# EAGLE schematic FEU (EAGLE 6.1)
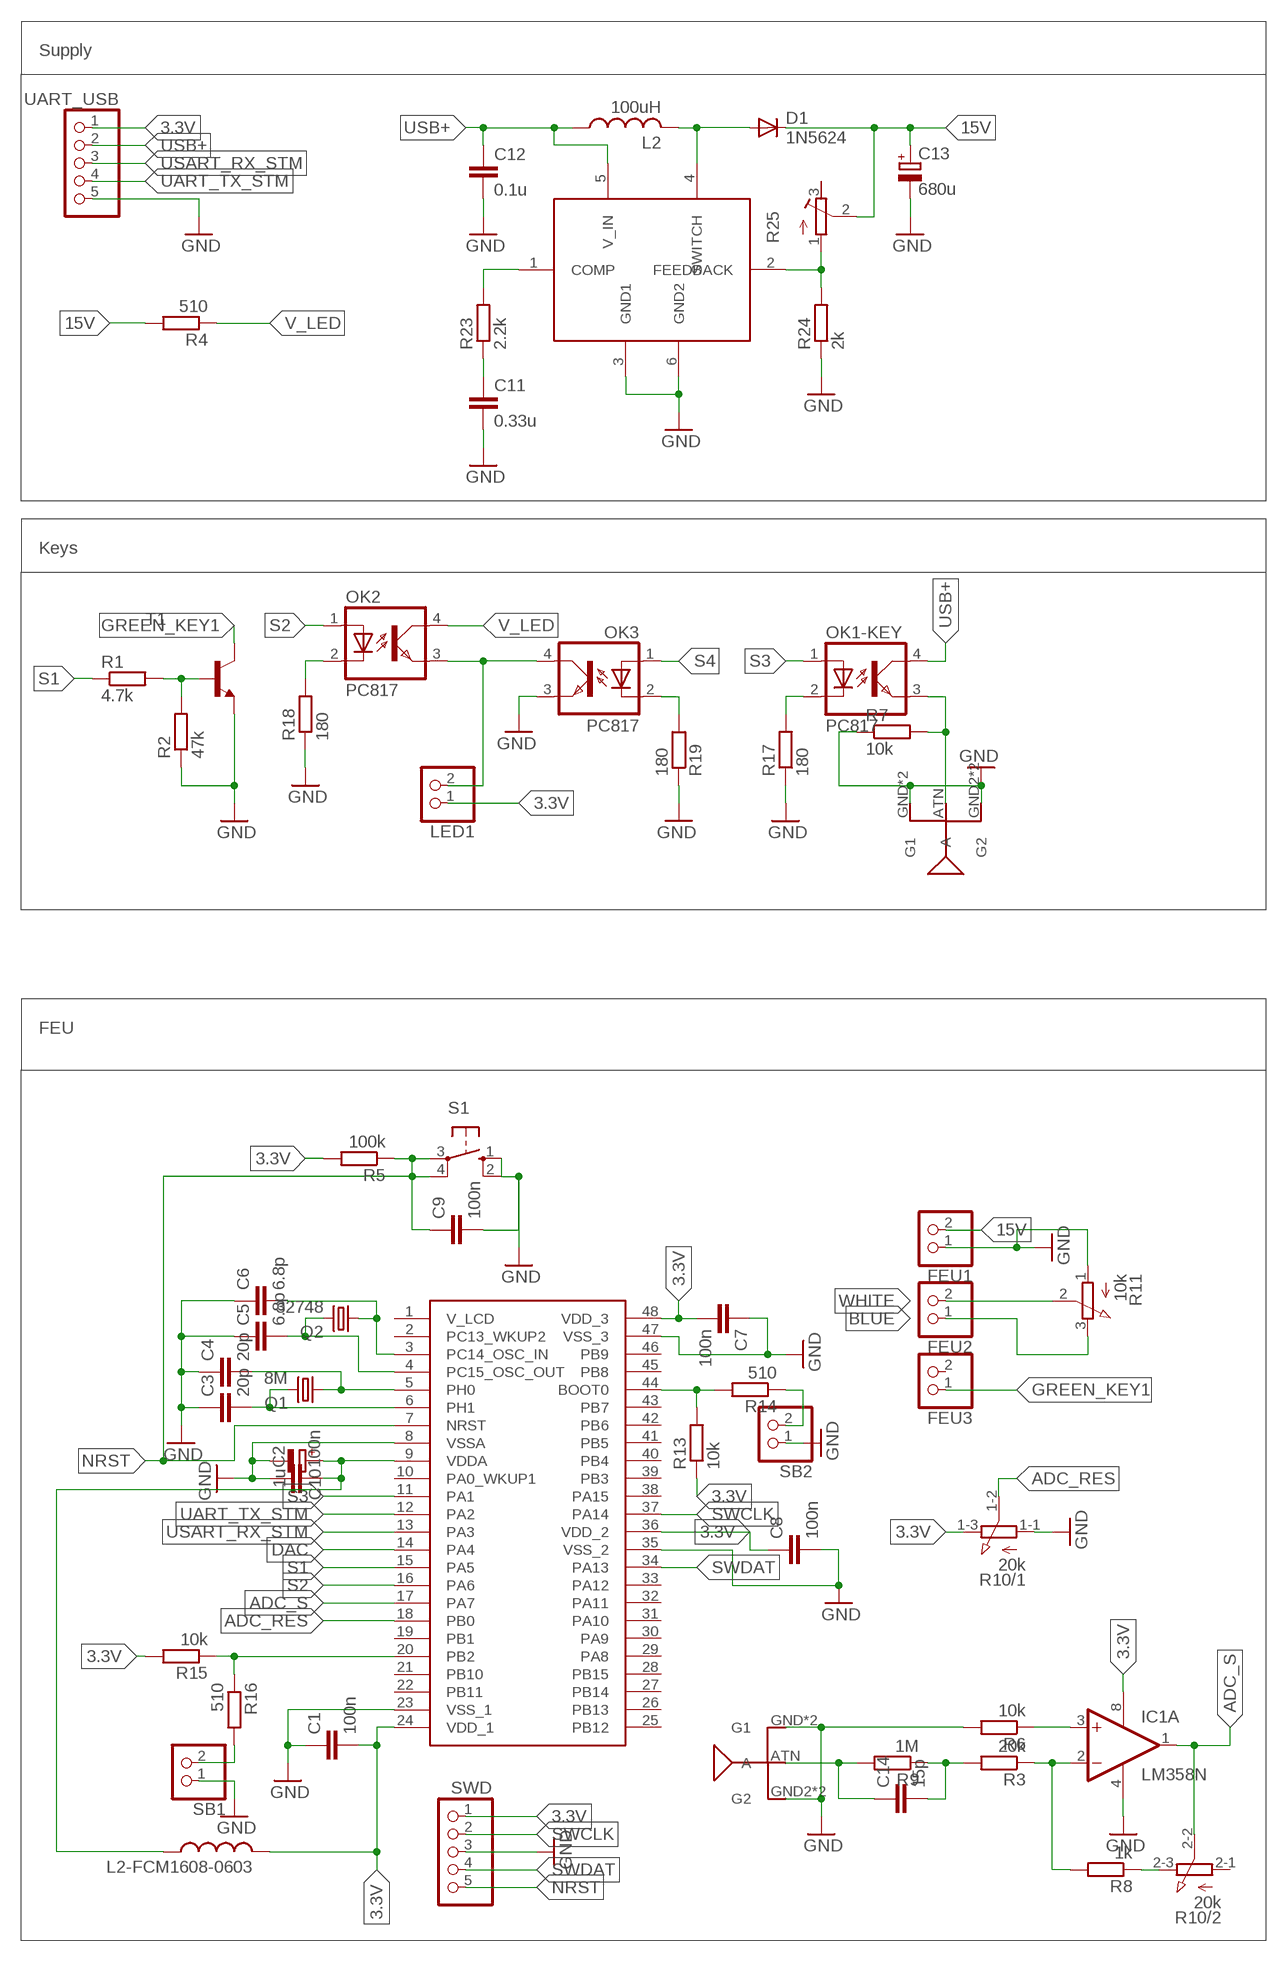
[diagram p0: schematic, sheet 1]

## Parts
C1  100n  C-EUC0805  [C0805]
C2  100n  C-EUC0805  [C0805]
C3  20p  C-EUC0805  [C0805]
C4  20p  C-EUC0805  [C0805]
C5  6.8p  C-EUC0805  [C0805]
C6  6.8p  C-EUC0805  [C0805]
C7  100n  C-EUC0805  [C0805]
C8  100n  C-EUC0805  [C0805]
C9  100n  C-EUC0805  [C0805]
C10  1u  CPOL-EUA/3216-18W  [A/3216-18W]
C11  0.33u  C-EUC0805  [C0805]
C12  0.1u  C-EUC0805  [C0805]
C13  680u  CPOL-EUE5-5  [E5-5]
C14  15p  C-EUC0805  [C0805]
D1  1N5624  [DO201-15]
FEU1  PINHD-1X2  [1X02]
FEU2  PINHD-1X2  [1X02]
FEU3  PINHD-1X2  [1X02]
IC1  LM358N  [DIL08]
L2  100uH  L-US0207/5V  [0207/5V]
L2-FCM1608-0603  L-USL3216C  [L3216C]
LED1  PINHD-1X2  [1X02]
OK1-KEY  PC817  [DIL04]
OK2  PC817  [DIL04]
OK3  PC817  [DIL04]
Q1  8M  CRYSTALHC49S  [HC49/S]
Q2  32748  CRYSTALTC26H  [TC26H]
R1  4.7k  R-EU_R0805  [R0805]
R2  47k  R-EU_R0805  [R0805]
R3  20k  R-EU_M1206  [M1206]
R4  510  R-EU_R0805  [R0805]
R5  100k  R-EU_R0805  [R0805]
R6  10k  R-EU_M1206  [M1206]
R7  10k  R-EU_R0805  [R0805]
R8  1k  R-EU_M1206  [M1206]
R9  1M  R-EU_M1206  [M1206]
R10  20k  3RP/1610G  [3RP/1610G]
R11  10k  3RP/1610N  [3RP/1610N]
R13  10k  R-EU_R0805  [R0805]
R14  510  R-EU_R0805  [R0805]
R15  10k  R-EU_R0805  [R0805]
R16  510  R-EU_R0805  [R0805]
R17  180  R-EU_R0805  [R0805]
R18  180  R-EU_R0805  [R0805]
R19  180  R-EU_R0805  [R0805]
R23  2.2k  R-EU_R0805  [R0805]
R24  2k  R-EU_R0805  [R0805]
R25  R-TRIMM3339P  [RTRIM3339P]
S1  10-XX  [B3F-10XX]
SB1  PINHD-1X2  [1X02]
SB2  PINHD-1X2  [1X02]
SWD  PINHD-1X5  [1X05]
T1  BC846B-NPN-SOT23-BEC  [SOT23-BEC]
U$1  STM32L152C6  [LQFP48]
U$2  GSM_ANT  [GSM]
U$3  GSM_ANT  [GSM]
U$4  LM2577  [TO263-5]
UART_USB  PINHD-1X5  [1X05]

## Nets
3.3V: C1.2 C7.2 C8.1 IC1.8(P:V+) L2-FCM1608-0603.2 LED1.1 R5.2 R10.1-3(/1:E) R13.1 R15.2 SWD.1 U$1.24(VDD_1) U$1.36(VDD_2) U$1.48(VDD_3) UART_USB.1
15V: C13.+ D1.C FEU1.2 R4.2 R25.2(S)
ADC_RES: R10.1-2(/1:S) U$1.18(PB0)
ADC_S: IC1.1(A:OUT) R10.2-2(/2:S) U$1.17(PA7)
BLUE: FEU2.1 R11.3(E)
DAC: U$1.14(PA4)
GND: C1.1 C2.1 C3.1 C4.1 C5.1 C6.1 C7.1 C8.2 C9.2 C10.- C11.2 C12.2 C13.- FEU1.1 IC1.4(P:V-) OK3.3(EMIT) R2.1 R6.2 R7.1 R10.1-1(/1:A) R11.1(A) R17.1 R18.1 R19.1 R24.1 S1.1(S) S1.2(S1) SB1.1 SB2.1 SWD.3 T1.E U$1.8(VSSA) U$1.23(VSS_1) U$1.35(VSS_2) U$1.47(VSS_3) U$2.GND1(G1) U$2.GND2(G2) U$2.GND3(G2) U$2.GND(G1) U$3.GND1(G1) U$3.GND2(G2) U$3.GND3(G2) U$3.GND(G1) U$4.3(GND1) U$4.6(GND2) UART_USB.5
GREEN_KEY1: FEU3.1 T1.C
N$1: C4.2 Q1.1 U$1.5(PH0)
N$2: C3.2 Q1.2 U$1.6(PH1)
N$3: C14.2 R3.2 R9.1
N$4: R1.2 R2.2 T1.B
N$6: IC1.2(A:-IN) R3.1 R8.2
N$7: C14.1 R9.2 U$2.ATN(A)
N$9: IC1.3(A:+IN) R6.1
N$10: R8.1 R10.2-3(/2:E)
N$13: C5.2 Q2.2 U$1.4(PC15_OSC_OUT)
N$14: C6.2 Q2.1 U$1.3(PC14_OSC_IN)
N$15: C2.2 C10.+ L2-FCM1608-0603.1 U$1.9(VDDA)
N$16: R13.2 R14.2 U$1.44(BOOT0)
N$17: R16.2 SB1.2
N$18: R14.1 SB2.2
N$19: R15.1 R16.1 U$1.20(PB2)
N$21: OK1-KEY.2(C) R17.2
N$23: OK1-KEY.3(EMIT) R7.2 U$3.ATN(A)
N$25: OK2.2(C) R18.2
N$26: R23.2 U$4.1(COMP)
N$27: C11.1 R23.1
N$28: R24.2 R25.1(E) U$4.2(FEEDBACK)
N$31: D1.A L2.2 U$4.4(SWITCH)
N$33: OK3.2(C) R19.2
N$34: LED1.2 OK2.3(EMIT) OK3.4(COL)
NRST: C9.1 R5.1 S1.3(P) S1.4(P1) SWD.5 U$1.7(NRST)
S1: R1.1 U$1.15(PA5)
S2: OK2.1(A) U$1.16(PA6)
S3: OK1-KEY.1(A) U$1.11(PA1)
S4: OK3.1(A)
SWCLK: SWD.2 U$1.37(PA14)
SWDAT: SWD.4 U$1.34(PA13)
UART_TX_STM: U$1.12(PA2) UART_USB.4
USART_RX_STM: U$1.13(PA3) UART_USB.3
USB+: C12.1 L2.1 OK1-KEY.4(COL) U$4.5(V_IN) UART_USB.2
V_LED: OK2.4(COL) R4.1
WHITE: FEU2.2 R11.2(S)
Unconnected: FEU3.2 IC1.5(B:+IN) IC1.6(B:-IN) IC1.7(B:OUT) R10.2-1(/2:A) R25.3(A) U$1.1(V_LCD) U$1.2(PC13_WKUP2) U$1.10(PA0_WKUP1) U$1.19(PB1) U$1.21(PB10) U$1.22(PB11) U$1.25(PB12) U$1.26(PB13) U$1.27(PB14) U$1.28(PB15) U$1.29(PA8) U$1.30(PA9) U$1.31(PA10) U$1.32(PA11) U$1.33(PA12) U$1.38(PA15) U$1.39(PB3) U$1.40(PB4) U$1.41(PB5) U$1.42(PB6) U$1.43(PB7) U$1.45(PB8) U$1.46(PB9)

## Notes on the sheet
- Supply
- Keys
- FEU

## Library data of the parts
C1-C9 C11 C12 C14 = resistor:C-EU: CAPACITOR, European symbol
C10 C13 = resistor:CPOL-EU: POLARIZED CAPACITOR, European symbol
D1 = diode:1N5624: DIODE controlled avalanche rectifier
FEU1-FEU3 LED1 SB1 SB2 = pinhead:PINHD-1X2: PIN HEADER
IC1 = linear:LM358: OP AMP also LM158; LM258; LM2904 Source: http://cache.national.com/ds/LM/LM158.pdf
L2 L2-FCM1608-0603 = resistor:L-US: INDUCTOR, American symbol
OK1-KEY OK2 OK3 = optocoupler:PC817: SHARP OPTO COUPLER; MPN: PC817X4J000F; OC_FARNELL: 9707727; OC_NEWARK: 97K7059
Q1 = crystal:CRYSTAL: CRYSTAL; OC_FARNELL: 1667008; OC_NEWARK: unknown
Q2 = crystal:CRYSTAL: CRYSTAL; OC_FARNELL: unknown; OC_NEWARK: unknown
R1-R9 R13-R19 R23 R24 = resistor:R-EU_: RESISTOR, European symbol
R10 = pot:3RP/1610G: 16mm Potentiometer two level Source: http://www.alphapotentiometers.net/html/16mm_pot_2.html
R11 = pot:3RP/1610N: 16mm Potentiometer one level Source: http://www.alphapotentiometers.net/html/16mm_pot_2.html
R25 = resistor:R-TRIMM: Trimm resistor
S1 = switch-omron:10-XX: OMRON SWITCH; MPN: B3F-1000; OC_FARNELL: 176432; OC_NEWARK: 36M3542
SWD UART_USB = pinhead:PINHD-1X5: PIN HEADER
T1 = transistor:*-NPN-: NPN Transistror BF959 corrected 2008.03.06
U$1 = STM32L152:STM32L152C6
U$2 U$3 = discrete:GSM_ANT
U$4 = LM2577:LM2577